# Altium project DP_UART_MAX232.PrjPcb
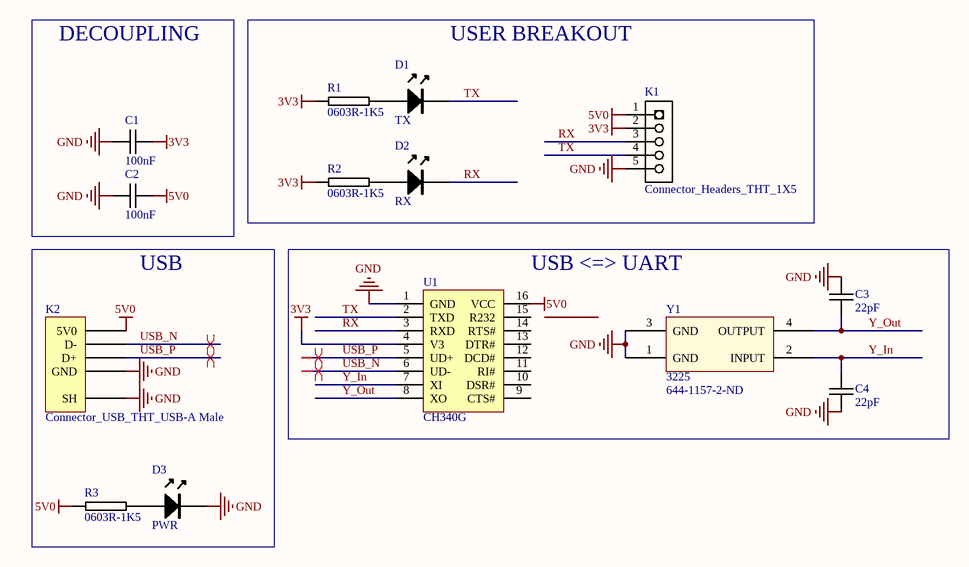
[diagram p0: DP_UART_RVA.SchDoc]
1 sheet, 14 parts. Net scope: global (net labels, ports and power ports of the same name join across sheets).
Board file: PCB - 100x100 - 85x85.PcbDoc

## Sheet DP_UART_RVA.SchDoc: CH340G breakout
size A4; Engineer: Robbe Van Assche; Address1: Robbe's Workshop; Revision: A; SheetNumber: 2; SheetTotal: 2

### Parts
C1  100nF  [0603C-GENERIC]
C2  100nF  [0603C-GENERIC]
C3  22pF  [0603C-GENERIC]
C4  22pF  [0603C-GENERIC]
D1  TX  [0805LED]
D2  RX  [0805LED]
D3  PWR  [0805LED]
K1  Connector_Headers_THT_1X5  [HEADER-1X5]
K2  Connector_USB_THT_USB-A Male  [USB-A - MALE]
R1  0603R-1K5  [0603R-1k5]
R2  0603R-1K5  [0603R-1k5]
R3  0603R-1K5  [0603R-1k5]
U1  CH340G  [SO16]
Y1  3225  Supplier Part Number 1: 644-1157-2-ND  [XTAL 3225]

### Blocks framed on the sheet
DECOUPLING: C1 C2
USER BREAKOUT: D1 D2 K1 R1 R2
USB: D3 K2 R3
USB <=> UART: C3 C4 U1 Y1

### Nets
3V3: C1.2 K1.2 R1.1 R2.1 U1.4(V3)
5V0: C2.2 K1.1 K2.4(5V0) R3.1 U1.16(VCC)
GND: C1.1 C2.1 C3.1 C4.2 D3.K K1.5 K2.0(SH) K2.1(GND) U1.1(GND) Y1.1(GND) Y1.3(GND)
RX: D2.K K1.3 U1.3(RXD)
TX: D1.K K1.4 U1.2(TXD)
USB_N: K2.3(D-) U1.6(UD-)
USB_P: K2.2(D+) U1.5(UD+)
Y_In: C4.1 U1.7(XI) Y1.2(INPUT)
Y_Out: C3.2 U1.8(XO) Y1.4(OUTPUT)
NetD1_A: D1.A R1.2
NetD2_A: D2.A R2.2
NetD3_A: D3.A R3.2

Not connected (* = marked no-connect by the designer): U1 9(CTS#) 10(DSR#) 11(RI#) 12(DCD#) 13(DTR#) 14(RTS#) 15(R232)

### Layout directives
differential pair: USB_N, USB_P

### Notes on the sheet
- Title
- Size:
- Date:
- A4
- Number:
- Time:
- Revision:
- Sheet
- of
- File:

### Library data of the parts
C1 C2 = Passives_Capacitors_0603_GENERIC: CAPACITOR 0603 CERAMIC GENERIC
C3 C4 = Passives_Capacitors_0603_22PF-50V-C0G-PAN: CAPACITOR 0603 CERAMIC; Manufacturer Part Number: ECJ-1VC1H220J; Manufacturer: Panasonic - ECG; Reel: C10; Tolerance: ±5%; Temperature Coefficient: C0G, NP0; Voltage - Rated: 50V; Supplier 1: Digi-Key; Features: General Purpose; Lead Spacing: -; Supplier: Digi-Key; Capacitance: 22pF; Packaging: Tape & Reel (TR); Mounting Type: Surface Mount, MLCC; RoHS: RoHS Compliant; Operating Temperature: -55°C ~ 125°C; Thickness: 0.80mm; Package / Case: 0603 (1608 metric); Category: Capacitors; Supplier Part Number 1: PCC220ACVTR-ND; Supplier Part Number: PCC220ACVTR-ND
D1-D3 = LED_SMD_0805
K1 = Connector_Headers_THT_1X5: PINHEADER 1X5; REEL: TH; Supplier 1: Digi-Key; Supplier Part Number 1: S1011E-36-ND
R1-R3 = 0603R-1K5: GENERIC RESISTOR 0603; Manufacturer Part Number: RMCF 1/16 15K 1% R; Manufacturer: Stackpole Electronics Inc; Tolerance: ±1%; Resistance In Ohms: 15.0K; Power (Watts): 0.1W, 1/10W; Temperature Coefficient: ±100ppm/°C; Supplier 1: Digi-Key; Supplier Part Number 1: RMCF1/1615KFRTR-ND; Supplier: Digi-Key; Supplier Part Number: RMCF1/1615KFRTR-ND; Packaging: Tape & Reel (TR); Category: Resistors; Case: 0603 (1608 metric); Composition: Thick Film; Lead Style: Surface Mount (SMD - SMT); RoHS: RoHS Compliant
Y1 = 3225 Quartz: Supplier 1: Digi-Key